# EAGLE design Shield_schematic_v09b (EAGLE 8.6.0)
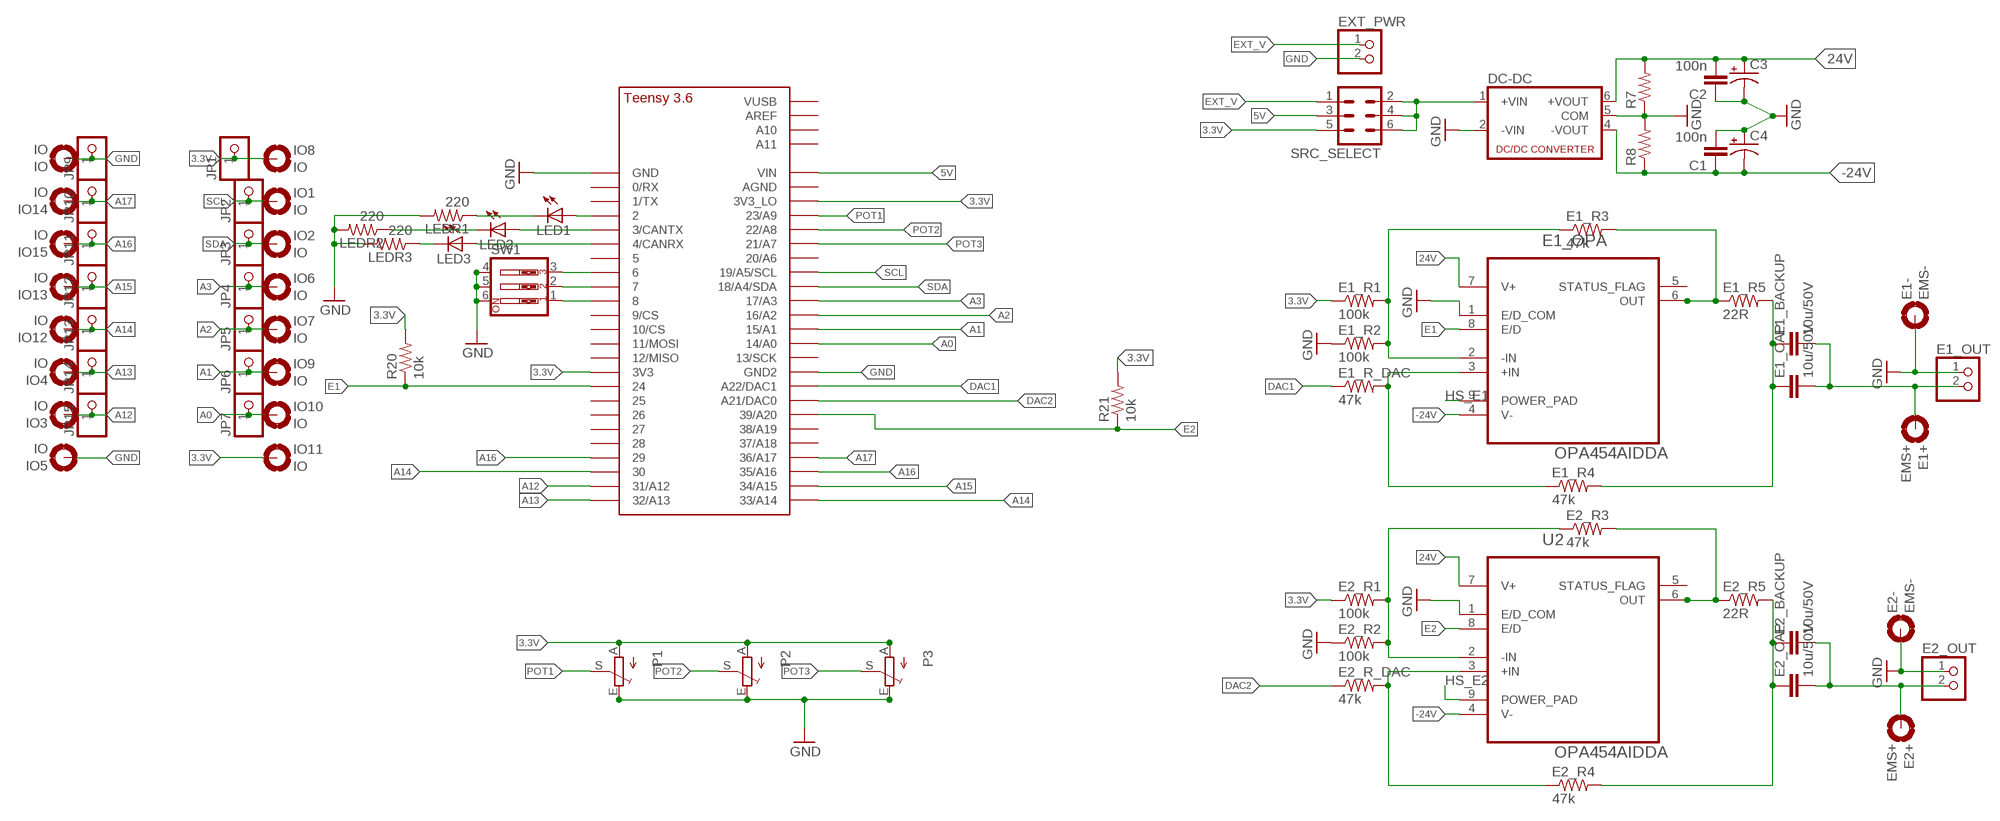
[diagram p0: schematic, sheet 1]

## Parts
C1  100n  CAP1206  [1206]
C2  100n  CAP1206  [1206]
C3  CPOL-USE2.5-5  [E2,5-5]
C4  CPOL-USE2.5-5  [E2,5-5]
DC-DC  NMA  [NMA]
E1+  EMS+  MOUNT-PAD-ROUND4.1  [4,1-PAD]
E1-  EMS-  MOUNT-PAD-ROUND4.1  [4,1-PAD]
E1_BACKUP  10u/50V  CAPPTH1  [CAP-PTH-5MM]
E1_CAP  10u/50V  CAP1206  [1206]
E1_OPA  OPA454AIDDA  [SOIC127P600X170-9N]
E1_OUT  PINHD-1X2  [1X02]
E1_R1  100k  RESISTOR1206  [1206]
E1_R2  100k  RESISTOR1206  [1206]
E1_R3  47k  RESISTOR1206  [1206]
E1_R4  47k  RESISTOR1206  [1206]
E1_R5  22R  RESISTOR1206  [1206]
E1_R_DAC  47k  RESISTOR1206  [1206]
E2+  EMS+  MOUNT-PAD-ROUND4.1  [4,1-PAD]
E2-  EMS-  MOUNT-PAD-ROUND4.1  [4,1-PAD]
E2_BACKUP  10u/50V  CAPPTH1  [CAP-PTH-5MM]
E2_CAP  10u/50V  CAP1206  [1206]
E2_OUT  PINHD-1X2  [1X02]
E2_R1  100k  RESISTOR1206  [1206]
E2_R2  100k  RESISTOR1206  [1206]
E2_R3  47k  RESISTOR1206  [1206]
E2_R4  47k  RESISTOR1206  [1206]
E2_R5  22R  RESISTOR1206  [1206]
E2_R_DAC  47k  RESISTOR1206  [1206]
EXT_PWR  PINHD-1X2  [1X02]
IO  IO  MOUNT-PAD-ROUND2.8  [2,8-PAD]
IO1  IO  MOUNT-PAD-ROUND2.8  [2,8-PAD]
IO2  IO  MOUNT-PAD-ROUND2.8  [2,8-PAD]
IO3  IO  MOUNT-PAD-ROUND2.8  [2,8-PAD]
IO4  IO  MOUNT-PAD-ROUND2.8  [2,8-PAD]
IO5  IO  MOUNT-PAD-ROUND2.8  [2,8-PAD]
IO6  IO  MOUNT-PAD-ROUND2.8  [2,8-PAD]
IO7  IO  MOUNT-PAD-ROUND2.8  [2,8-PAD]
IO8  IO  MOUNT-PAD-ROUND2.8  [2,8-PAD]
IO9  IO  MOUNT-PAD-ROUND2.8  [2,8-PAD]
IO10  IO  MOUNT-PAD-ROUND2.8  [2,8-PAD]
IO11  IO  MOUNT-PAD-ROUND2.8  [2,8-PAD]
IO12  IO  MOUNT-PAD-ROUND2.8  [2,8-PAD]
IO13  IO  MOUNT-PAD-ROUND2.8  [2,8-PAD]
IO14  IO  MOUNT-PAD-ROUND2.8  [2,8-PAD]
IO15  IO  MOUNT-PAD-ROUND2.8  [2,8-PAD]
JP1  PINHD-1X1  [1X01]
JP2  PINHD-1X1  [1X01]
JP3  PINHD-1X1  [1X01]
JP4  PINHD-1X1  [1X01]
JP5  PINHD-1X1  [1X01]
JP6  PINHD-1X1  [1X01]
JP7  PINHD-1X1  [1X01]
JP9  PINHD-1X1  [1X01]
JP10  PINHD-1X1  [1X01]
JP11  PINHD-1X1  [1X01]
JP12  PINHD-1X1  [1X01]
JP13  PINHD-1X1  [1X01]
JP14  PINHD-1X1  [1X01]
JP15  PINHD-1X1  [1X01]
LED1  LEDCHIPLED_0805  [CHIPLED_0805]
LED2  LEDCHIPLED_0805  [CHIPLED_0805]
LED3  LEDCHIPLED_0805  [CHIPLED_0805]
LEDR1  220  RESISTOR1206  [1206]
LEDR2  220  RESISTOR1206  [1206]
LEDR3  220  RESISTOR1206  [1206]
P1  TRIM_EU-B25P  [B25P]
P2  TRIM_EU-B25P  [B25P]
P3  TRIM_EU-B25P  [B25P]
R7  RESISTORKIT  [AXIAL-0.3-KIT]
R8  RESISTORKIT  [AXIAL-0.3-KIT]
R20  10k  RESISTOR1206  [1206]
R21  10k  RESISTOR1206  [1206]
SRC_SELECT  MA03-2  [MA03-2]
SW1  SW_DIP-3  [EDG-03]
U2  OPA454AIDDA  [SOIC127P600X170-9N]
U$1  TEENSY_3.5/3.6_BASIC  [TEENSY_3.5/3.6_BASIC]

## Nets
3.3V: E1_R1.1 E2_R1.1 IO8.B2,8(MOUNT) IO11.B2,8(MOUNT) JP1.1 P1.A P2.A P3.A R20.2 R21.2 SRC_SELECT.5 U$1.3V3 U$1.3V3_LO
5V: SRC_SELECT.3 U$1.VIN
24V: C2.2 C3.+ DC-DC.6(+VOUT) E1_OPA.7(V+) R7.P$2 U2.7(V+)
-24V: C1.1 C4.- DC-DC.4(-VOUT) E1_OPA.4(V-) R8.P$1 U2.4(V-)
A0: IO10.B2,8(MOUNT) JP7.1 U$1.14/A0
A1: IO9.B2,8(MOUNT) JP6.1 U$1.15/A1
A2: IO7.B2,8(MOUNT) JP5.1 U$1.16/A2
A3: IO6.B2,8(MOUNT) JP4.1 U$1.17/A3
A12: IO3.B2,8(MOUNT) JP15.1 U$1.31/A12
A13: IO4.B2,8(MOUNT) JP14.1 U$1.32/A13
A14: IO12.B2,8(MOUNT) JP13.1 U$1.30 U$1.33/A14
A15: IO13.B2,8(MOUNT) JP12.1 U$1.34/A15
A16: IO15.B2,8(MOUNT) JP11.1 U$1.29 U$1.35/A16
A17: IO14.B2,8(MOUNT) JP10.1 U$1.36/A17
DAC1: E1_R_DAC.1 U$1.A22/DAC1
DAC2: E2_R_DAC.1 U$1.21/DAC0(A21/DAC0)
E1: E1_OPA.8(E/D) R20.1 U$1.24
E1+: E1+.B4,1(MOUNT) E1_BACKUP.2 E1_CAP.2 E1_OUT.2
E2: R21.1 U2.8(E/D) U$1.39/A20
E2+: E2+.B4,1(MOUNT) E2_BACKUP.2 E2_CAP.2 E2_OUT.2
EXT_V: EXT_PWR.1 SRC_SELECT.1
GND: C1.2 C2.1 C3.- C4.+ DC-DC.2(-VIN) DC-DC.5(COM) E1-.B4,1(MOUNT) E1_OPA.1(E/D_COM) E1_OUT.1 E1_R2.1 E2-.B4,1(MOUNT) E2_OUT.1 E2_R2.1 EXT_PWR.2 IO5.B2,8(MOUNT) IO.B2,8(MOUNT) JP9.1 LEDR1.2 LEDR2.2 LEDR3.2 P1.E P2.E P3.E R7.P$1 R8.P$2 SW1.4 SW1.5 SW1.6 U2.1(E/D_COM) U$1.GND U$1.GND2
HS_E1: E1_OPA.9(POWER_PAD)
HS_E2: U2.9(POWER_PAD)
N$1: SW1.1 U$1.8
N$2: E1_OPA.3(+IN) E1_R4.1 E1_R_DAC.2
N$3: E1_BACKUP.1 E1_CAP.1 E1_R4.2 E1_R5.2
N$4: LED1.A U$1.2
N$5: E1_OPA.6(OUT) E1_R3.2 E1_R5.1
N$6: SW1.2 U$1.7
N$7: E1_OPA.2(-IN) E1_R1.2 E1_R2.2 E1_R3.1
N$8: SW1.3 U$1.6
N$9: E2_R4.1 E2_R_DAC.2 U2.3(+IN)
N$10: E2_BACKUP.1 E2_CAP.1 E2_R4.2 E2_R5.2
N$11: LED2.A U$1.3/CANTX
N$12: E2_R3.2 E2_R5.1 U2.6(OUT)
N$13: LED3.A U$1.4/CANRX
N$14: E2_R1.2 E2_R2.2 E2_R3.1 U2.2(-IN)
N$15: LED1.C LEDR1.1
N$16: DC-DC.1(+VIN) SRC_SELECT.2 SRC_SELECT.4 SRC_SELECT.6
N$18: LED2.C LEDR2.1
N$19: LED3.C LEDR3.1
POT1: P1.S U$1.23/A9
POT2: P2.S U$1.22/A8
POT3: P3.S U$1.21/A7
SCL: IO1.B2,8(MOUNT) JP2.1 U$1.19/A5/SCL
SDA: IO2.B2,8(MOUNT) JP3.1 U$1.18/A4/SDA
Unconnected: E1_OPA.5(STATUS_FLAG) U2.5(STATUS_FLAG) U$1.0/RX U$1.1/TX U$1.5 U$1.9/CS U$1.10/CS U$1.11/MOSI U$1.12/MISO U$1.13/SCK U$1.20/A6 U$1.25 U$1.26 U$1.27 U$1.28 U$1.37/A18 U$1.38/A19 U$1.A10 U$1.A11 U$1.AGND U$1.AREF U$1.VUSB

## Library data of the parts
C1 C2 = SparkFun-Capacitors:CAP: Capacitor Standard 0603 ceramic capacitor, and 0.1" leaded capacitor.; C3: 100n
C3 C4 = resistor:CPOL-US: POLARIZED CAPACITOR, American symbol
DC-DC = dc-dc-converter:NMA: DC-DC CONVERTER; MF: C & D TECHNOLOGIES, INC; MPN: NMA0515SC; OC_FARNELL: 1021434; OC_NEWARK: 61K3064
E1+ E1- E2+ E2- IO IO1-IO15 = holes:MOUNT-PAD-ROUND: MOUNTING PAD, round
E1_BACKUP E1_CAP E2_BACKUP E2_CAP = SparkFun-Capacitors:CAP: Capacitor Standard 0603 ceramic capacitor, and 0.1" leaded capacitor.; C3: 10u/50V
E1_OPA U2 = Texas Instruments_By_element14_Batch_1:OPA454AIDDA: OPERATIONAL AMPLIFIERS; MPN: OPA454AIDDA; OC_FARNELL: 1703220; OC_NEWARK: 73M3405; PACKAGE: SOIC-8; SUPPLIER: Texas Instruments
E1_OUT E2_OUT EXT_PWR = pinhead:PINHD-1X2: PIN HEADER
E1_R1 E2_R1 = SparkFun-Resistors:RESISTOR: Resistor Basic schematic elements and footprints for 0603, 1206, and PTH resistors.; R4: 100k
E1_R2 E2_R2 = SparkFun-Resistors:RESISTOR: Resistor Basic schematic elements and footprints for 0603, 1206, and PTH resistors.; R3: 100k
E1_R3 E2_R3 = SparkFun-Resistors:RESISTOR: Resistor Basic schematic elements and footprints for 0603, 1206, and PTH resistors.; R5: 47k
E1_R4 E2_R4 = SparkFun-Resistors:RESISTOR: Resistor Basic schematic elements and footprints for 0603, 1206, and PTH resistors.; R7: 47k
E1_R5 E2_R5 R7 R8 = SparkFun-Resistors:RESISTOR: Resistor Basic schematic elements and footprints for 0603, 1206, and PTH resistors.; R1: 22
E1_R_DAC E2_R_DAC = SparkFun-Resistors:RESISTOR: Resistor Basic schematic elements and footprints for 0603, 1206, and PTH resistors.; R6: 47k
JP1-JP7 JP9-JP15 = pinhead:PINHD-1X1: PIN HEADER
LED1-LED3 = led:LED: LED OSRAM: - CHIPLED LG R971, LG N971, LY N971, LG Q971, LY Q971, LO R971, LY R971 LH N974, LH R974 LS Q976, LO Q976, LY Q976 LO Q996 - Hyper CHIPLED LW Q18S LB Q993, LB Q99A, LB R99A - SideLED LS A670, LO A670, LY A670, LG A670, LP A670 LB A673, LV A673, LT A673, LW A673 LH A674 LY A675 LS A676, LA A676, LO A676, LY A676, LW A676 LS A679, LY A679, LG A679 - Hyper Micro SIDELED® LS Y876, LA Y876, LO Y876, LY Y876 LT Y87S - SmartLED LW L88C, LW L88S LB L89C, LB L89S, LG L890 LS L89K, LO L89K, LY L89K LS L896, LA L896, LO L896, LY L896 - TOPLED LS T670, LO T670, LY T670, LG T670, LP T670 LSG T670, LSP T670, LSY T670, LOP T670, LYG T670 LG T671, LOG T671, LSG T671 LB T673, LV T673, LT T673, LW T673 LH T674 LS T676, LA T676, LO T676, LY T676, LB T676, LH T676, LSB T676, LW T676 LB T67C, LV T67C, LT T67C, LS T67K, LO T67K, LY T67K, LW E67C LS E67B, LA E67B, LO E67B, LY E67B, LB E67C, LV E67C, LT E67C LW T67C LS T679, LY T679, LG T679 LS T770, LO T770, LY T770, LG T770, LP T770 LB T773, LV T773, LT T773, LW T773 LH T774 LS E675, LA E675, LY E675, LS T675 LS T776, LA T776, LO T776, LY T776, LB T776 LHGB T686 LT T68C, LB T68C - Hyper Mini TOPLED® LB M676 - Mini TOPLED Santana® LG M470 LS M47K, LO M47K, LY M47K Source: http://www.osram.convergy.de LUXEON: - LUMILED® LXK2-PW12-R00, LXK2-PW12-S00, LXK2-PW14-U00, LXK2-PW14-V00 LXK2-PM12-R00, LXK2-PM12-S00, LXK2-PM14-U00 LXK2-PE12-Q00, LXK2-PE12-R00, LXK2-PE12-S00, LXK2-PE14-T00, LXK2-PE14-U00 LXK2-PB12-K00, LXK2-PB12-L00, LXK2-PB12-M00, LXK2-PB14-N00, LXK2-PB14-P00, LXK2-PB14-Q00 LXK2-PR12-L00, LXK2-PR12-M00, LXK2-PR14-Q00, LXK2-PR14-R00 LXK2-PD12-Q00, LXK2-PD12-R00, LXK2-PD12-S00 LXK2-PH12-R00, LXK2-PH12-S00 LXK2-PL12-P00, LXK2-PL12-Q00, LXK2-PL12-R00 Source: www.luxeon.com KINGBRIGHT: KA-3528ASYC Source: www.kingbright.com
LEDR1-LEDR3 R20 R21 = SparkFun-Resistors:RESISTOR: Resistor Basic schematic elements and footprints for 0603, 1206, and PTH resistors.
P1-P3 = pot:TRIM_EU-: POTENTIOMETER
SRC_SELECT = con-lstb:MA03-2: PIN HEADER; OC_FARNELL: unknown; OC_NEWARK: unknown
SW1 = special:SW_DIP-3: DIP SWITCH
U$1 = Teensy356:TEENSY_3.5/3.6_BASIC

## Board
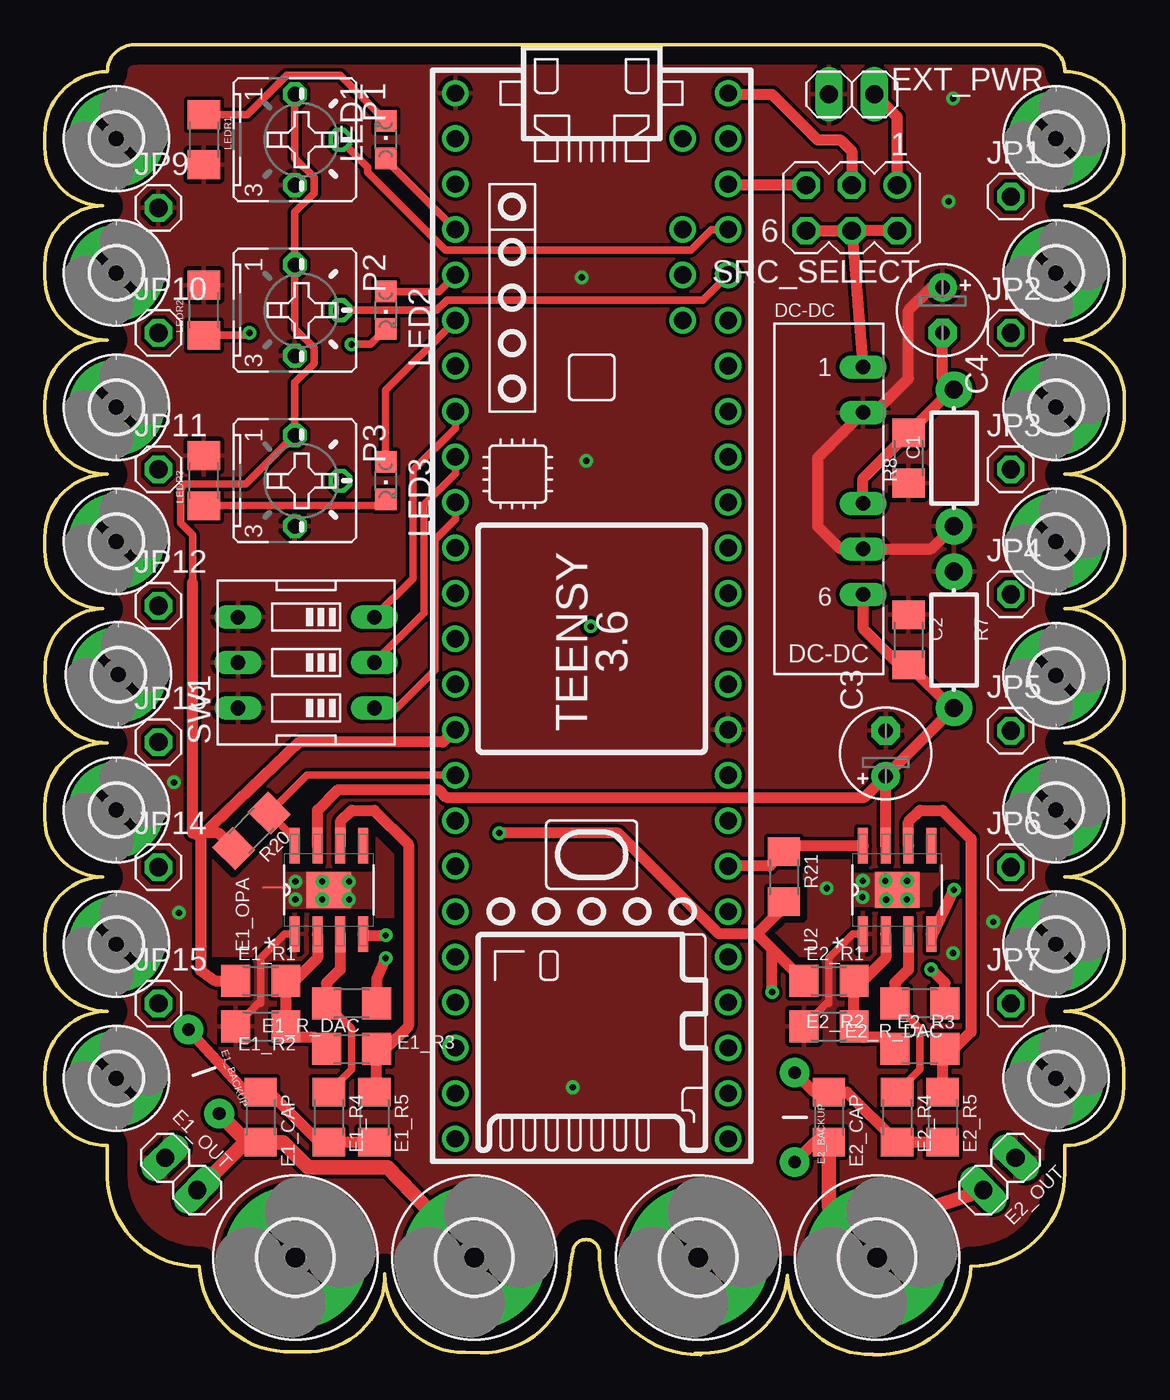
[diagram p1: board, top side]
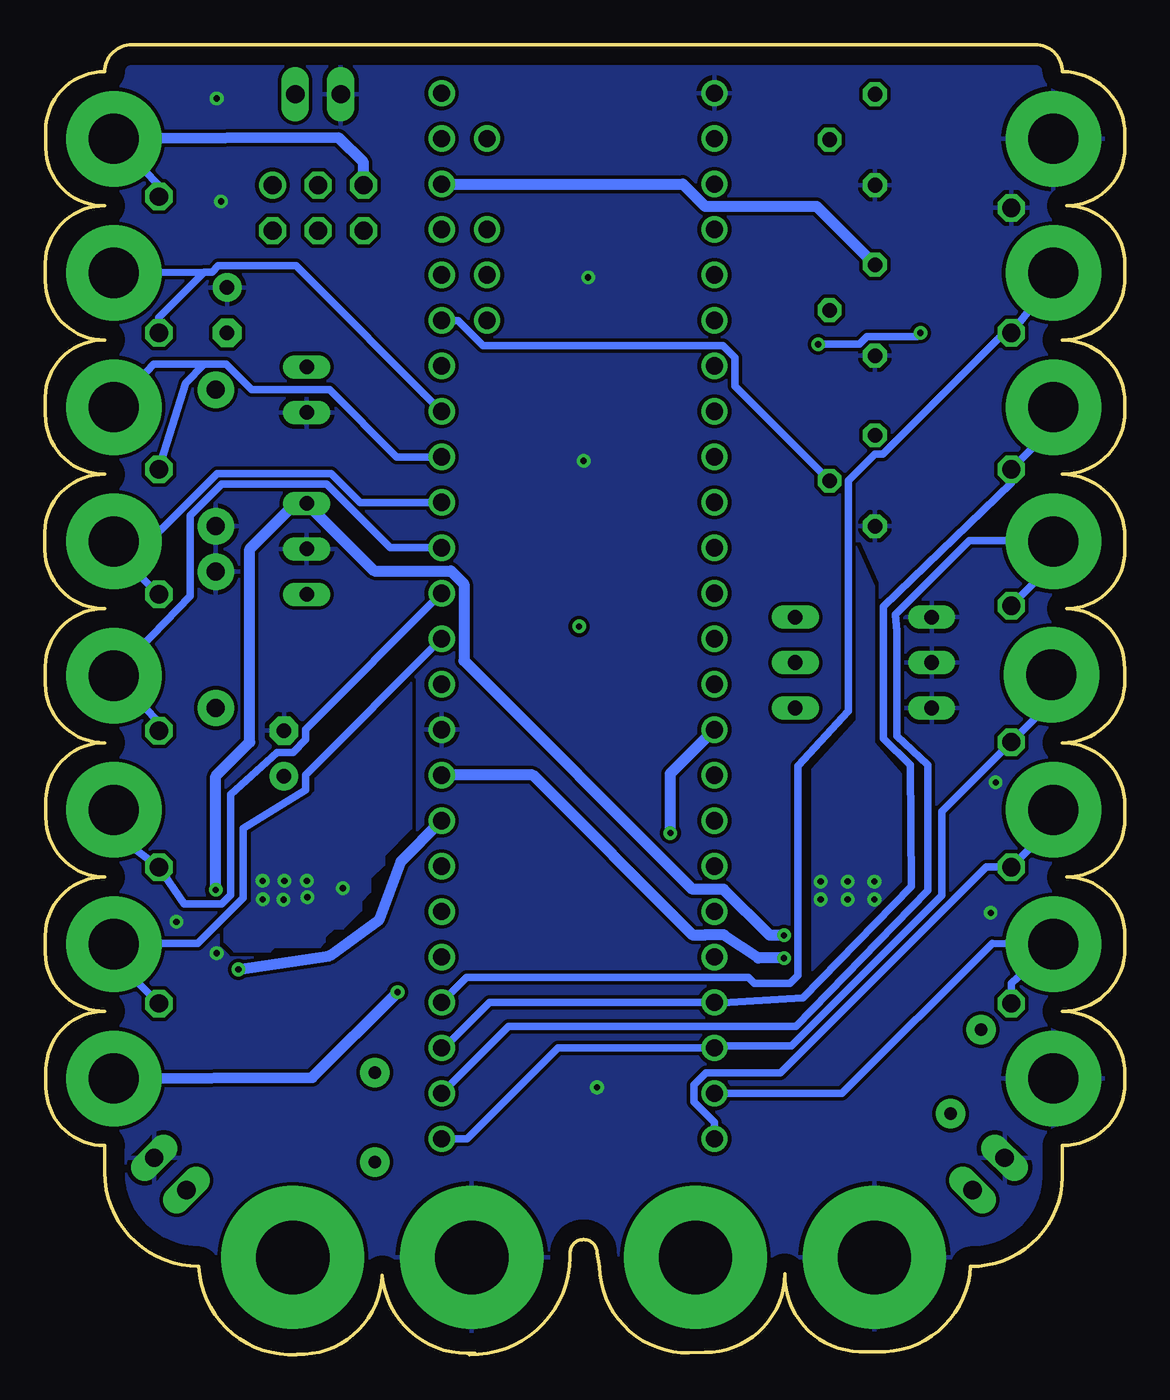
[diagram p2: board, bottom side, seen from below]

Size 60.35 x 73.19 mm. Coordinates in mm from the lower left corner, seen from the top.
Outline: 3.5,11.69 3.5,9.94 arc90 8.63,4.94 arc90 13.85,0.18 14.85,0.18 arc90 19,4.52 arc90 23.48,0.13 24.35,0.11 arc90 29.35,4.92 29.5,5.69 arc-90 30.25,6.44 arc-90 31,5.69 31,5.44 arc90 36.62,0 36.32,0.09 arc90 41.5,4.44 arc90 46.26,0.02 46.28,0 arc90 51.75,4.94 arc90 57,10.19 57,11.69 arc90 60.29,14.94 60.29,15.94 arc90 57,19.19 arc90 60.32,22.44 60.32,23.44 arc90 57,26.69 arc90 60.29,30.01 60.29,31.01 arc90 57,34.19 arc90 60.33,37.47 60.33,38.47 arc90 57,41.69 arc90 60.35,44.97 60.35,45.97 arc90 57,49.19 arc90 60.33,52.52 60.33,53.52 arc90 57,56.69 arc90 60.33,59.99 60.33,60.99 arc90 57,64.19 arc90 60.3,67.41 60.3,68.41 arc90 57,71.69 arc90 55.5,73.19 5,73.19 arc90 3.5,71.69 arc90 0,68.19 0,67.44 arc90 3.25,64.19 arc90 0,60.94 0,60.19 arc90 3.5,56.69 arc90 0,53.19 0,52.69 arc90 3.5,49.19 arc90 0,45.69 0,44.94 arc90 3.25,41.69 arc90 0.02,38.32 0,37.69 arc90 3.5,34.19 arc90 0,30.69 0,29.94 arc90 3.25,26.69 arc90 0,23.44 0,22.69 arc90 3.5,19.19 arc90 0,15.69 0,15.19 arc90 3.5,11.69
Copper layers (1*16): Top 0.035mm / dielectric 1.5mm / Bottom 0.035mm
Design rules "default *": minimum track width 12mil, minimum drill 0.35mm, track to track 8mil, track to pad 8mil, pad to pad 8mil, via to via 8mil, smd to smd 8mil, copper to edge 40mil, drill to drill 6mil, minimum pad ring 10mil, minimum via ring 8mil, stop-mask expansion 4mil, vias tented up to drill 0mil, thermal gap 10mil

### Footprints (pad centres in the part's own frame; a part is rotated, then mirrored left to right if it is on the bottom)
1206 = smd 1.6 x 1.8: 1 -1.4,0; 2 1.4,0
E2,5-5 = drill 0.813 pad 1.6: + -1.27,0 | drill 0.813 pad 1.6 octagon: - 1.27,0
NMA = drill 0.813 long: 1 0,6.35; 2 0,3.81; 4 0,-1.27; 5 0,-3.81; 6 0,-6.35
4,1-PAD = drill 4.1 pad 8: B4,1 0,0
CAP-PTH-5MM = drill 0.7 pad 1.651: 1 -2.5,0; 2 2.5,0
SOIC127P600X170-9N = smd 1.981 x 0.559: 1 -2.464,1.905; 2 -2.464,0.635; 3 -2.464,-0.635; 4 -2.464,-1.905; 5 2.464,-1.905; 6 2.464,-0.635; 7 2.464,0.635; 8 2.464,1.905 | smd 2.007 x 2.489: 9 0,0
1X02 = drill 1.016 long: 1 -1.27,0; 2 1.27,0
2,8-PAD = drill 2.8 pad 5.334: B2,8 0,0
1X01 = drill 1.016 octagon: 1 0,0
CHIPLED_0805 = smd 1.2 x 1.2: A 0,-1.05; C 0,1.05
B25P = drill 0.813 octagon: A -2.54,0; E 2.54,0; S 0,2.54
AXIAL-0.3-KIT = drill 1.016 pad 2.032: P$1 -3.81,0; P$2 3.81,0
MA03-2 = drill 1.016: 1 -2.54,-1.27 | drill 1.016 octagon: 2 -2.54,1.27; 3 0,-1.27; 4 0,1.27; 5 2.54,-1.27; 6 2.54,1.27
EDG-03 = drill 0.813 long: 1 -2.54,-3.81; 2 0,-3.81; 3 2.54,-3.81; 4 2.54,3.81; 5 0,3.81; 6 -2.54,3.81
TEENSY_3.5/3.6_BASIC = drill 0.965: 0/RX -25.4,-7.62; 1/TX -22.86,-7.62; 2 -20.32,-7.62; 3/CANTX -17.78,-7.62; 3V3 7.62,-7.62; 3V3_LO -22.86,7.62; 4/CANRX -15.24,-7.62; 5 -12.7,-7.62; 6 -10.16,-7.62; 7 -7.62,-7.62; 8 -5.08,-7.62; 9/CS -2.54,-7.62; 10/CS 0,-7.62; 11/MOSI 2.54,-7.62; 12/MISO 5.08,-7.62; 13/SCK 5.08,7.62; 14/A0 2.54,7.62; 15/A1 0,7.62; 16/A2 -2.54,7.62; 17/A3 -5.08,7.62; 18/A4/SDA -7.62,7.62; 19/A5/SCL -10.16,7.62; 20/A6 -12.7,7.62; 21/A7 -15.24,7.62; 21/DAC0 12.7,7.62; 22/A8 -17.78,7.62; 23/A9 -20.32,7.62; 24 10.16,-7.62; 25 12.7,-7.62; 26 15.24,-7.62; 27 17.78,-7.62; 28 20.32,-7.62; 29 22.86,-7.62; 30 25.4,-7.62; 31/A12 27.94,-7.62; 32/A13 30.48,-7.62; 33/A14 30.48,7.62; 34/A15 27.94,7.62; 35/A16 25.4,7.62; 36/A17 22.86,7.62; 37/A18 20.32,7.62; 38/A19 17.78,7.62; 39/A20 15.24,7.62; A10 -17.78,5.08; A11 -15.24,5.08; A22/DAC1 10.16,7.62; AGND -25.4,7.62; AREF -20.32,5.08; GND -27.94,-7.62; GND2 7.62,7.62; VIN -27.94,7.62; VUSB -25.4,5.08

### Placement (x,y rotation side)
C1  48.26,50.1 270 top
C2  48.26,39.94 270 top
C3  46.99,33.59 90 top
C4  50.16,58.36 270 top
DC-DC  45.72,48.83 0 top
E1+  24,5.44 0 top
E1-  14,5.44 0 top
E1_BACKUP  8.89,15.81 290 top
E1_CAP  12.06,13.27 270 top
E1_OPA  15.88,25.97 90 top
E1_OUT  7.62,10.1 315 top
E1_R1  12.06,20.89 0 top
E1_R2  12.06,18.35 0 top
E1_R3  17.14,17.08 0 top
E1_R4  15.88,13.27 270 top
E1_R5  18.41,13.27 270 top
E1_R_DAC  17.14,19.62 180 top
E2+  46.5,5.44 0 top
E2-  36.5,5.44 0 top
E2_BACKUP  41.91,13.27 270 top
E2_CAP  43.81,13.27 270 top
E2_OUT  53.34,10.1 225 top
E2_R1  43.81,20.89 0 top
E2_R2  43.81,18.35 0 top
E2_R3  48.9,17.08 0 top
E2_R4  47.62,13.27 270 top
E2_R5  50.16,13.27 270 top
E2_R_DAC  48.9,19.62 180 top
EXT_PWR  45.09,70.42 180 top
IO  4,67.94 0 top
IO1  56.5,60.44 0 top
IO2  56.5,52.94 0 top
IO3  4,22.94 0 top
IO4  4,30.44 0 top
IO5  4,15.44 0 top
IO6  56.5,45.44 0 top
IO7  56.5,37.94 0 top
IO8  56.5,67.94 0 top
IO9  56.5,30.44 0 top
IO10  56.5,22.94 0 top
IO11  56.5,15.44 0 top
IO12  4.12,37.99 0 top
IO13  4,45.44 0 top
IO14  4,60.44 0 top
IO15  4,52.94 0 top
JP1  53.98,64.71 0 top
JP2  53.98,57.09 0 top
JP3  53.98,49.47 0 top
JP4  53.98,42.48 0 top
JP5  53.98,34.86 0 top
JP6  53.98,27.24 0 top
JP7  53.98,19.62 0 top
JP9  6.35,64.07 0 top
JP10  6.35,57.09 0 top
JP11  6.35,49.47 0 top
JP12  6.35,41.85 0 top
JP13  6.35,34.23 0 top
JP14  6.35,27.24 0 top
JP15  6.35,19.62 0 top
LED1  19.05,67.88 0 top
LED2  19.05,58.36 180 top
LED3  19.05,48.83 180 top
LEDR1  8.89,67.88 270 top
LEDR2  8.89,58.36 90 top
LEDR3  8.89,48.83 90 top
P1  13.97,67.88 270 top
P2  13.97,58.36 270 top
P3  13.97,48.83 270 top
R7  50.8,39.94 270 top
R8  50.8,50.1 270 top
R20  11.56,29.28 225 top
R21  41.3,26.7 270 top
SRC_SELECT  45.09,64.07 180 top
SW1  14.61,38.67 90 top
U2  47.62,25.97 90 top
U$1  30.56,42.54 270 top

### Tracks (layer width: path | path; a pad name or v marks a point on that pad's centre or on a via)
3.3V  (via drill 0.35)
  Top 0.406: P1.A 13.97,66.85 15.04,65.79 15.04,64.9 13.97,63.83 P2.A 13.97,57.33 15.04,56.26 15.04,55.38 13.97,54.31 P3.A 11.24,48.64 7.82,48.64 7.58,48.4 7.58,46.47 8.26,45.79 8.26,43.12
  Top 0.61: 8.7,28.96 8.7,21.46 9.53,20.89 E1_R1.1 | E2_R1.1 40.64,22.67 | 40.64,22.67 39.79,23.52 | 39.79,23.52 37.66,23.52 32.03,29.15 v25.4,29.15 | U$1.3V3 22.25,34.23 14.22,34.23 8.7,28.96 | SRC_SELECT.5 38.24,65.34 U$1.3V3_LO | 8.26,29.15 8.26,43.12 | 8.26,29.15 8.7,28.96 | v40.64,20.26 40.64,22.67 | 39.79,23.52 41.3,25.02 R21.2 | R20.2 9.7,29.15 8.26,29.15
  Bottom 0.406: JP1.1 53.98,65.35 IO8.B2,8
  Bottom 0.61: v25.4,29.15 25.4,32.46 U$1.3V3 | SRC_SELECT.5 42.55,66.61 43.92,67.99 IO8.B2,8 | P3.A 13.72,51.12 | IO11.B2,8 45.41,15.49 v40.64,20.26 | U$1.3V3_LO 24.7,65.4 23.46,64.16 17.23,64.16 P2.A
5V
  Top 0.61: U$1.VIN 38.24,70.42 40.64,70.42 43.18,67.88 44.45,67.88 45.09,67.25 SRC_SELECT.3
24V
  Top 0.61: DC-DC.6 45.72,40.58 47.76,38.54 C2.2 50.67,36.13 R7.P$2 C3.+ | U2.7 C3.+ | E1_OPA.7 15.24,30.42 16.39,31.57 21.99,31.57 22.42,31.14 45.8,31.14 C3.+
-24V  (via drill 0.35)
  Top 0.61: DC-DC.4 45.72,48.96 C1.1 50.67,53.91 R8.P$1 50.16,54.55 C4.- | U2.4 49.61,23.43 v50.8,25.97 | E1_OPA.4 17.86,23.43 v19.05,23.43
  Bottom 0.61: v50.8,25.97 50.8,32.32 48.9,34.23 48.9,45.02 46.35,47.56 DC-DC.4 41.95,43.79 37.66,43.79 36.94,43.06 36.94,38.78 24.16,26.01 22.42,26.01 19.85,23.43 v19.05,23.43
A0
  Bottom 0.406: U$1.14/A0 45.78,32.4 45.78,31.56 49.28,29.4 49.28,25.53 51.81,22.99 56.52,22.99 | 56.52,22.99 IO10.B2,8 | JP7.1 56.52,22.16 56.52,22.99
A1
  Bottom 0.406: U$1.15/A1 45.78,34.94 45.78,34.36 46.49,33.66 47.36,33.66 49.97,31.3 49.97,25.69 50.48,25.19 52.55,25.19 JP6.1 56.43,29.06 56.43,30.49 IO9.B2,8
A2
  Bottom 0.406: U$1.16/A2 41.07,45.08 44.62,48.63 50.48,48.63 52.22,46.88 52.22,42.39 IO7.B2,8 53.98,35.35 JP5.1
A3
  Bottom 0.406: U$1.17/A3 42.75,47.62 44.37,49.24 50.73,49.24 54.47,45.49 IO6.B2,8 56.62,45.12 JP4.1
A12
  Bottom 0.406: U$1.31/A12 15.81,14.6 7.42,22.99 IO3.B2,8 6.35,20.76 JP15.1
A13
  Bottom 0.406: 4.51,30.49 IO4.B2,8 4.12,29.48 JP14.1 7.76,27.24 19.26,15.75 23.41,15.75 24.08,15.08 24.08,14.13 22.94,12.99 U$1.32/A13
A14
  Bottom 0.406: U$1.33/A14 36.77,12.06 31.69,17.14 U$1.30 22.34,17.24 18.64,17.24 10.22,25.66 10.22,30.36 JP13.1 4.12,36.46 IO12.B2,8
A15
  Bottom 0.406: U$1.34/A15 34.43,18.35 18.39,18.35 11,25.94 11,32.94 12.75,34.58 12.75,40.44 12.84,41.34 8.68,45.49 4.45,45.49 | 4.45,45.49 IO13.B2,8 | JP12.1 4.45,43.75 4.45,45.49
A16
  Bottom 0.406: U$1.35/A16 38.04,17.14 35.5,19.68 U$1.29 22.99,19.63 18,19.94 11.95,26.16 12,32.94 13.5,34.44 13.5,41.79 6.35,48.69 JP11.1 4.12,51.7 IO15.B2,8
A17
  Bottom 0.406: U$1.36/A17 36.78,21.08 21.04,21.08 20.71,20.74 18.73,20.74 18.27,21.2 18.27,32.89 15.44,35.97 15.44,48.83 13.97,50.31 13.53,50.31 6.99,56.85 JP10.1 4.12,59.96 IO14.B2,8
DAC1  (via drill 0.35)
  Top 0.61: v19.05,22.16 18.55,21.02 E1_R_DAC.1
  Bottom 0.61: v19.05,22.16 20.48,22.16 22.42,23.47 23.46,23.47 23.49,23.43 24.13,23.43 33.08,32.38 U$1.A22/DAC1
DAC2  (via drill 0.35)
  Top 0.61: E2_R_DAC.1 50.3,20.76 v49.53,21.53
  Bottom 0.61: v49.53,21.53 44.45,22.29 41.66,24.32 40.45,27.56 U$1.21/DAC0
E1
  Top 0.406: U$1.24 14.66,32.38 R20.1 13.97,28.84 E1_OPA.8
E1+
  Top 0.813: E1+.B4,1 19.14,10.46 14.72,10.46 13.31,11.87 E1_CAP.2 | E1_CAP.2 11.19,11.87 E1_OUT.2 | E1_BACKUP.2 11.34,11.87 E1_CAP.2
E2
  Top 0.61: U2.8 41.63,28.44 R21.1 40.49,27.3 U$1.39/A20
E2+
  Top 0.61: E2_CAP.2 43.01,11.87 E2_BACKUP.2
  Top 0.813: E2_CAP.2 43.81,8.29 E2+.B4,1 46.62,5.91 48.63,7.93 E2_OUT.2
EXT_V
  Top 0.61: SRC_SELECT.1 47.62,69.15 EXT_PWR.1
GND  (via drill 0.35)
  Top 0.406: E1_R2.1 11.94,19.62 12.06,19.62 12.06,22.16 13.41,23.51 E1_OPA.1 | E2_R2.1 43.69,19.62 43.81,19.62 43.81,22.16 45.16,23.51 U2.1
  Top 0.61: R8.P$2 49.53,45.02 DC-DC.5 44.45,45.02 43.18,46.29 43.18,50.1 DC-DC.2 46.35,52.64 48.26,54.55 48.26,58.36 49.53,59.63 C4.+
  other vias: 7.22,31.97 7.5,24.69 50.75,22.44 53,24.19 30,60.19 30.25,49.94 29.5,14.94 50.75,70.19 50.5,64.44
  pour Top (rank 2): 4,71.19 arc90 0.75,67.94 arc90 4,64.69 4,63.69 arc90 0.75,60.44 arc90 4,57.19 4,56.19 arc90 0.75,52.94 arc90 4,49.69 4,48.69 arc90 0.75,45.44 arc90 4,42.19 4,41.19 arc90 0.75,37.94 arc90 4,34.69 4,33.69 arc90 0.75,30.44 arc90 4,27.19 4,26.19 arc90 0.75,22.94 arc90 4,19.69 4,18.69 arc90 0.75,15.44 arc90 4,12.19 4,10.69 arc90 9.25,5.44 arc90 14,0.69 arc90 18.75,5.44 19.25,5.44 arc90 24,0.69 arc90 28.75,5.44 28.75,5.69 arc-90 30.25,7.19 arc-90 31.75,5.69 arc90 36.75,0.69 arc90 41.25,5.19 41.25,5.44 41.75,5.44 arc90 46.5,0.69 arc90 51.25,5.44 arc90 56.5,10.69 56.5,12.19 arc90 59.75,15.44 arc90 56.5,18.69 56.5,19.69 arc90 59.75,22.94 arc90 56.5,26.19 56.5,27.19 arc90 59.75,30.44 arc90 56.5,33.69 56.5,34.69 arc90 59.75,37.94 arc90 56.5,41.19 56.5,42.19 arc90 59.75,45.44 arc90 56.5,48.69 56.5,49.69 arc90 59.75,52.94 arc90 56.5,56.19 56.5,57.19 arc90 59.75,60.44 arc90 56.5,63.69 56.5,64.69 arc90 59.75,67.94 arc90 56.5,71.19 arc90 55,72.69 6,72.69 arc90
  pour Bottom (rank 2): 4,71.19 arc90 0.75,67.94 arc90 4,64.69 4,63.69 arc90 0.75,60.44 arc90 4,57.19 4,56.19 arc90 0.75,52.94 arc90 4,49.69 4,48.69 arc90 0.75,45.44 arc90 4,42.19 4,41.19 arc90 0.75,37.94 arc90 4,34.69 4,33.69 arc90 0.75,30.44 arc90 4,27.19 4,26.19 arc90 0.75,22.94 arc90 4,19.69 4,18.69 arc90 0.75,15.44 arc90 4,12.19 4,10.69 arc90 9.25,5.44 arc90 14,0.69 arc90 18.75,5.44 19.25,5.44 arc90 24,0.69 arc90 28.75,5.44 28.75,5.69 arc-90 30.25,7.19 arc-90 31.75,5.69 arc90 36.75,0.69 arc90 41.25,5.19 41.25,5.44 41.75,5.44 arc90 46.5,0.69 arc90 51.25,5.44 arc90 56.5,10.69 56.5,12.19 arc90 59.75,15.44 arc90 56.5,18.69 56.5,19.69 arc90 59.75,22.94 arc90 56.5,26.19 56.5,27.19 arc90 59.75,30.44 arc90 56.5,33.69 56.5,34.69 arc90 59.75,37.94 arc90 56.5,41.19 56.5,42.19 arc90 59.75,45.44 arc90 56.5,48.69 56.5,49.69 arc90 59.75,52.94 arc90 56.5,56.19 56.5,57.19 arc90 59.75,60.44 arc90 56.5,63.69 56.5,64.69 arc90 59.75,67.94 arc90 56.5,71.19 arc90 55,72.69 6,72.69 arc90
HS_E1  (via drill 0.35)
  Top 0.127: v14,26.44 13.66,26.1 12.19,26.1
  other vias: 14,25.44 15.5,26.44 15.5,25.44 17,26.44 17,25.44
  pour Bottom (no thermals): 12.5,32.44 14,34.19 14,42.94 15,45.19 15,35.44 17.5,32.69 17.5,21.44 12.5,26.44
  pour Top (no thermals): 18.5,28.94 19.5,27.94 19.5,24.44 18.5,24.44 18.5,24.94 13.25,24.94 13.25,26.94 18.5,26.94
  pour Top: 12.95,28.89 10.67,26.61 10.41,26.61 9.4,27.62 9.4,22.29 13.21,22.29 13.21,28.64
HS_E2  (via drill 0.35)
  other vias: 45.71,26.47 45.69,25.56 43.7,26.06 47.01,25.42 48.17,25.44 48.18,26.48 46.97,26.47
  pour Top (no thermals): 40.89,23.56 42.16,22.29 44.96,22.29 44.96,25.08 49.53,25.08 49.53,25.85 50.29,26.61 51.05,26.61 51.05,28.64 50.29,29.4 50.04,29.4 50.04,26.86 44.96,26.86 44.96,27.62 42.67,27.62 42.67,27.12 42.42,26.86 42.42,26.61 42.67,26.35 42.67,24.32 42.42,24.07 41.4,24.07
  pour Bottom (no thermals): 39.88,37.53 39.88,29.4 41.4,27.88 41.4,27.37 42.16,26.61 42.16,25.85 42.67,25.34 42.67,24.83 43.69,23.81 44.2,23.81 44.7,23.31 44.7,23.05 44.96,22.8 47.5,22.8 47.75,22.54 49.78,22.54 50.29,23.05 50.29,23.81 48.77,25.34 48.77,29.15 45.21,31.43 45.21,32.2
N$1
  Top 0.406: SW1.1 19.68,36.13 21.8,38.25 21.8,45.56 22.94,46.7 U$1.8
N$2
  Top 0.406: E1_R4.1 17.14,15.94 17.14,18.22 E1_R_DAC.2
  Top 0.61: E1_OPA.3 16.51,21.53 15.74,20.76 E1_R_DAC.2
N$3
  Top 0.61: E1_R5.2 E1_R4.2 15.37,11.87 12.57,14.67 E1_CAP.1 11.26,14.67 E1_BACKUP.1
N$4
  Top 0.406: U$1.2 19.05,66.75 LED1.A
N$5
  Top 0.61: E1_R5.1 18.55,14.8 E1_R3.2 19.05,17.08 20.32,18.35 20.32,28.51 18.41,30.42 17.14,30.42 16.51,29.78 E1_OPA.6
N$6
  Top 0.406: SW1.2 21.19,41.45 21.19,47.49 22.94,49.24 U$1.7
N$7
  Top 0.61: E1_R3.1 15.11,17.72 13.34,17.72 13.34,18.22 E1_R2.2 E1_R1.2 13.97,20.89 15.24,22.16 E1_OPA.2
N$8
  Top 0.406: SW1.3 20.58,43.38 20.58,49.42 22.94,51.78 U$1.6
N$9
  Top 0.406: E2_R4.1 48.9,15.94 48.9,18.22 E2_R_DAC.2
  Top 0.61: U2.3 48.26,21.53 47.49,20.76 E2_R_DAC.2
N$10
  Top 0.61: E2_R5.2 E2_R4.2 44.83,14.67 E2_CAP.1 43.01,14.67 E2_BACKUP.1
N$11
  Top 0.406: U$1.3/CANTX 22.02,59.41 LED2.A
N$12
  Top 0.61: U2.6 48.26,29.78 48.9,30.42 50.16,30.42 51.75,28.83 51.75,18.04 50.16,16.45 | E2_R3.2 50.16,16.95 50.16,16.45 | 50.16,16.45 E2_R5.1
N$13
  Top 0.406: U$1.4/CANRX 19.05,53.89 LED3.A
N$14
  Top 0.61: E2_R3.1 46.86,17.72 45.72,17.72 45.22,18.22 E2_R2.2 E2_R1.2 45.72,20.89 46.99,22.16 U2.2
N$15
  Top 0.406: LEDR1.1 11.32,69.28 13.53,71.49 16.49,71.49 LED1.C
N$16
  Top 0.61: SRC_SELECT.4 DC-DC.1 | SRC_SELECT.2 SRC_SELECT.4 | SRC_SELECT.6 SRC_SELECT.4
N$18  (via drill 0.35)
  Top 0.406: LED2.C 18.2,56.45 v17.14,56.45 | v11.43,57.09 11.3,56.96 LEDR2.1
  Bottom 0.406: v17.14,56.45 14.84,56.45 14.41,56.89 11.63,56.89 v11.43,57.09
N$19
  Top 0.406: LED3.C 18.7,47.43 LEDR3.1
N$21  (via drill 0.35)
  other vias: 30.5,40.69
POT1
  Top 0.406: P1.S 18.04,66.35 18.04,66.07 22.39,61.72 36.11,61.72 37.26,62.86 U$1.23/A9
POT2
  Top 0.406: P2.S 21.9,58.36 22.47,58.93 36.78,58.93 U$1.22/A8
POT3
  Bottom 0.406: U$1.21/A7 37.26,57.78 35.86,56.39 22.47,56.39 21.8,55.72 21.8,54.12 P3.S
SCL
  Bottom 0.406: 51.44,60.49 51.01,60.49 50.66,60.84 46.31,60.84 U$1.19/A5/SCL | 51.44,60.49 IO1.B2,8 | JP2.1 53.98,57.95 51.44,60.49
SDA
  Bottom 0.406: U$1.18/A4/SDA 40.7,50.16 44.45,53.91 48.79,53.91 50.21,55.34 51.44,55.34 | 51.44,55.34 54.27,55.34 IO2.B2,8 | JP3.1 52.48,54.3 51.44,55.34

### Text on the board
_bsilk: - | + | 3.3 5 EXT | Jarrod Knibbe / Paul Strohmeier / www.body-ui.eu | S1 | S2 | GND | GND